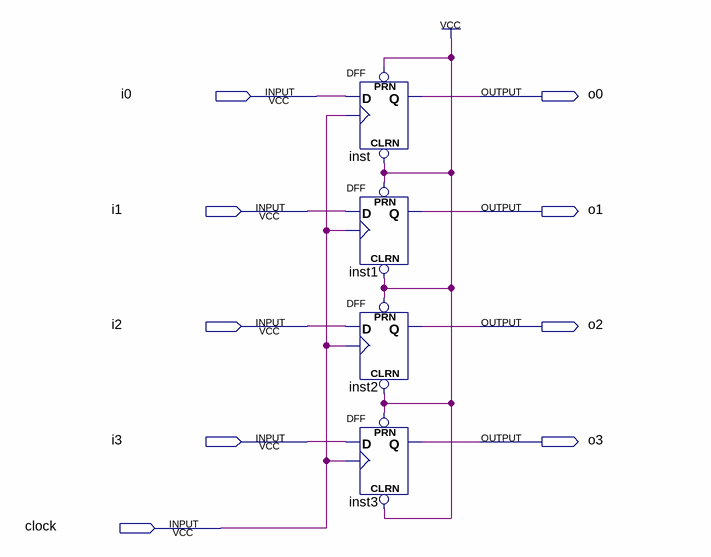
[diagram p0: schematic sheet]
// Quartus schematic deslocamento2.bdf as structural Verilog: 4 symbols, 9 pins
module deslocamento2 (
  input  i0,
  input  i1,
  input  i2,
  input  i3,
  input  clock,
  output o0,
  output o1,
  output o2,
  output o3
);

  DFF inst (.CLRN(1'b1), .CLK(clock), .D(i0), .PRN(1'b1), .Q(o0));
  DFF inst1 (.CLRN(1'b1), .CLK(clock), .D(i1), .PRN(1'b1), .Q(o1));
  DFF inst2 (.CLRN(1'b1), .CLK(clock), .D(i2), .PRN(1'b1), .Q(o2));
  DFF inst3 (.CLRN(1'b1), .CLK(clock), .D(i3), .PRN(1'b1), .Q(o3));
endmodule
